# Altium schematic sheet Wigglagotchi.SchDoc: Wigglagotchi
size A3; Revision: 1; SheetNumber: 1; SheetTotal: 1; SPICEModelCacheJNQJJNNR: <root> / <DocumentId>JNQJJNNR</DocumentId> / </root>
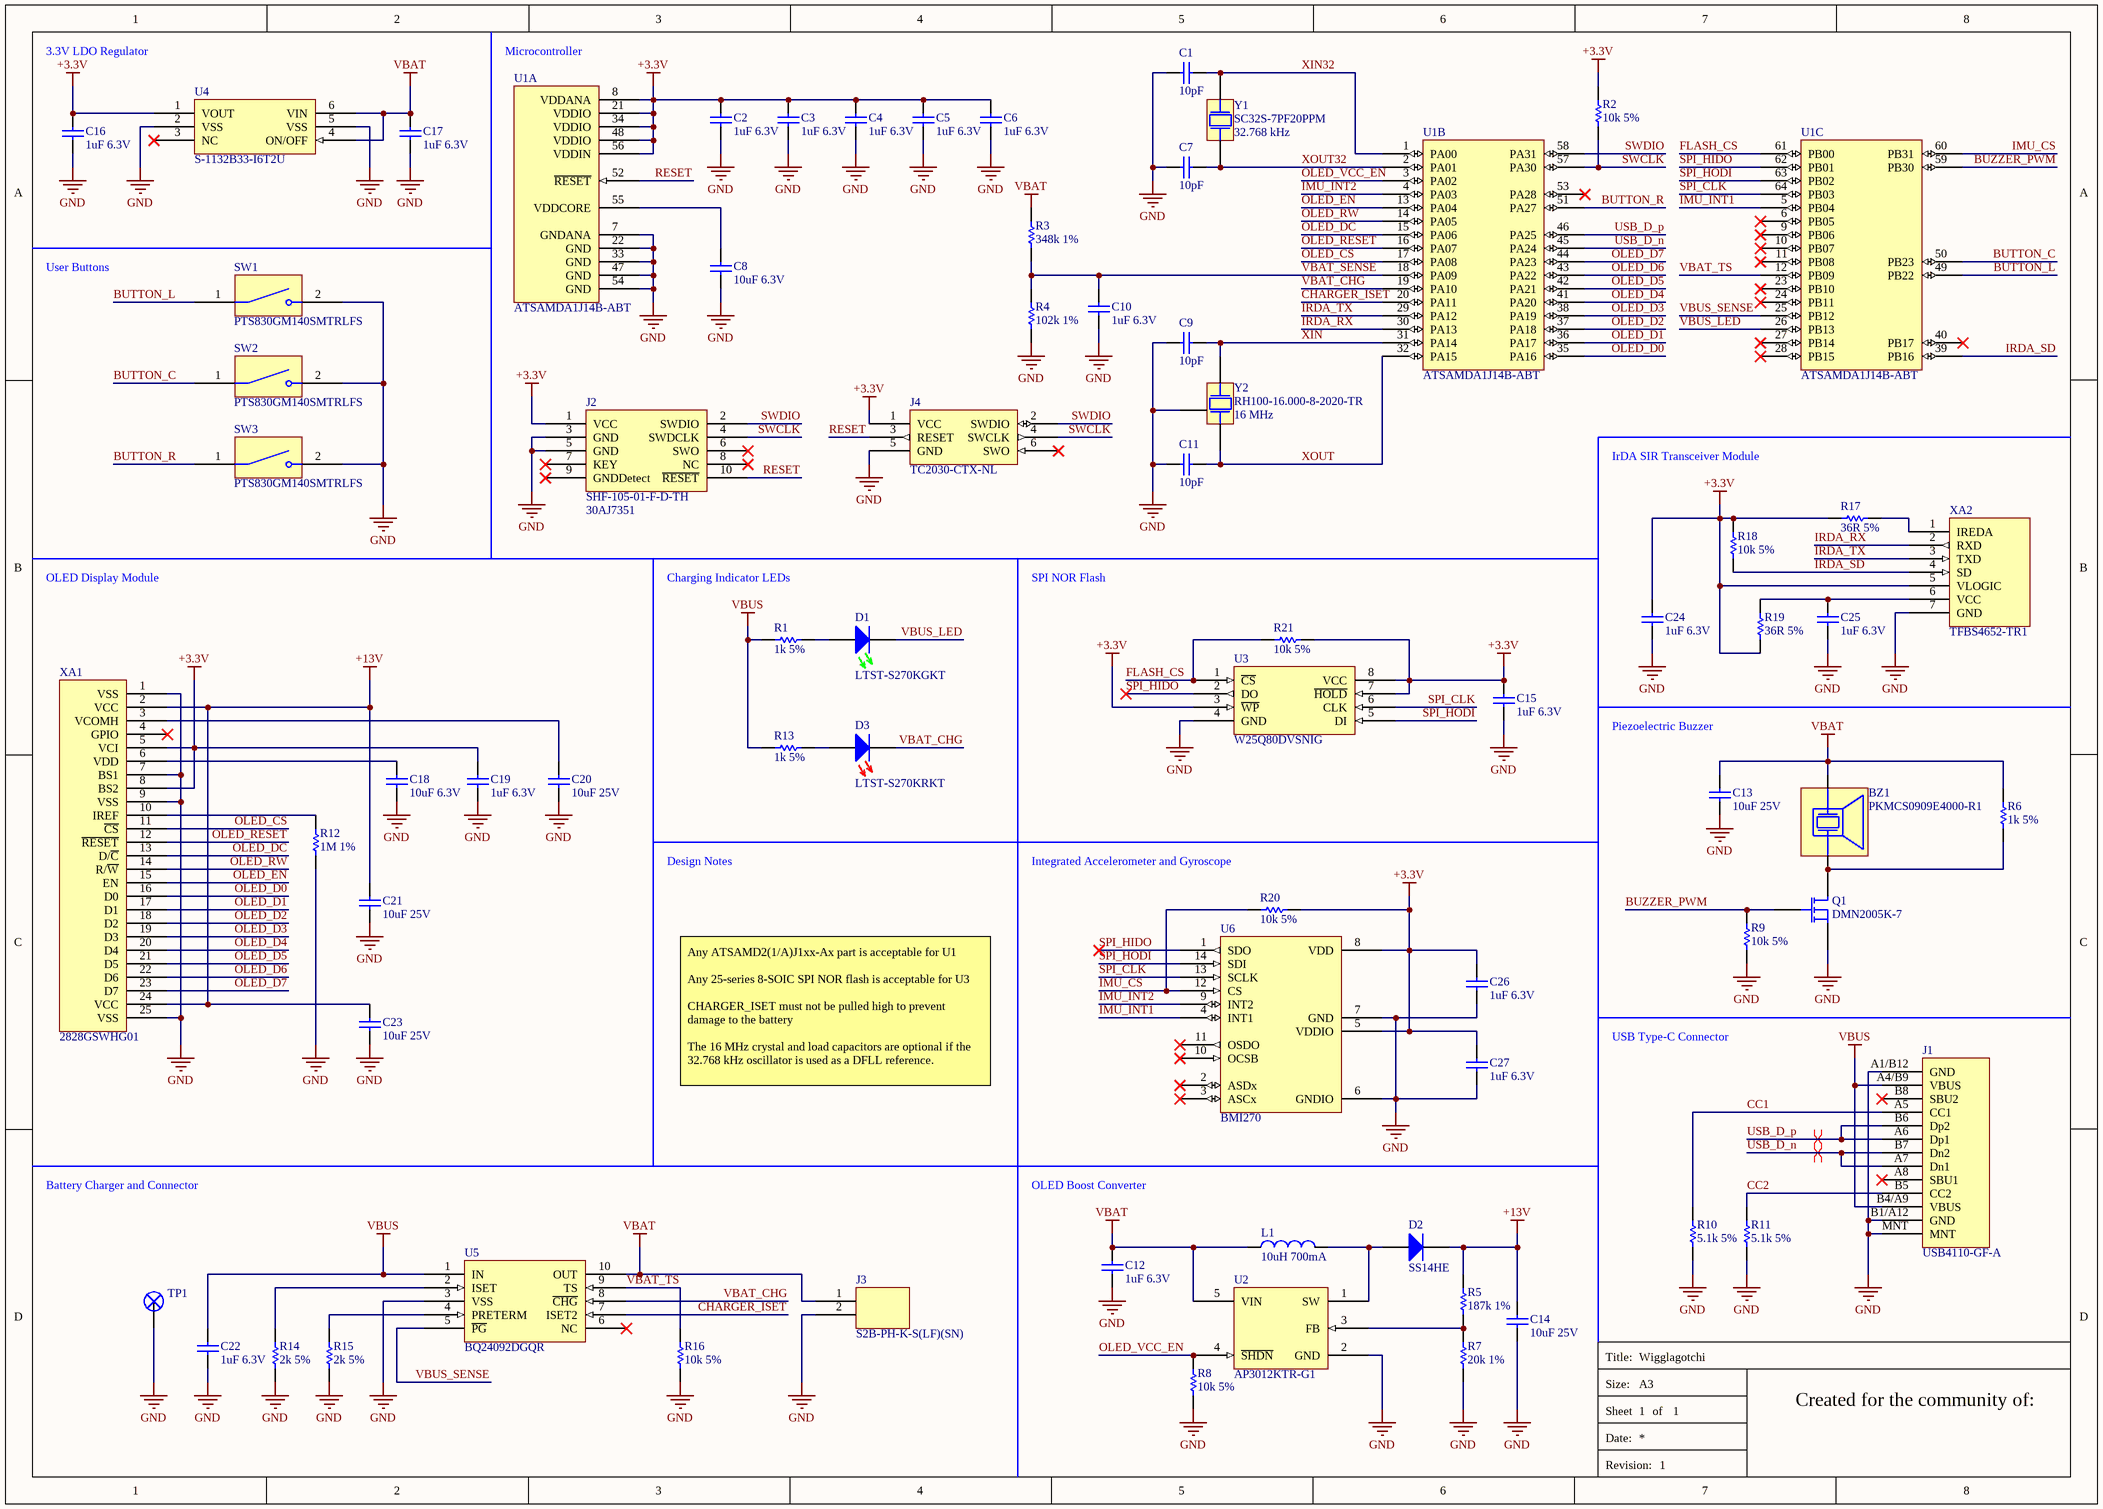
[diagram p0: Wigglagotchi.SchDoc]

## Parts
BZ1  PKMCS0909E4000-R1  [PKMCS0909E4000-R1]
C1  value 10pF  [GRM155 0402 Capacitor]  (hidden comment: GCM1555C1H100GA16D)
C2  value 1uF 6.3V  [GRM155 0402 Capacitor]  (hidden comment: GRM153R60J105ME15D)
C3  value 1uF 6.3V  [GRM155 0402 Capacitor]  (hidden comment: GRM153R60J105ME15D)
C4  value 1uF 6.3V  [GRM155 0402 Capacitor]  (hidden comment: GRM153R60J105ME15D)
C5  value 1uF 6.3V  [GRM155 0402 Capacitor]  (hidden comment: GRM153R60J105ME15D)
C6  value 1uF 6.3V  [GRM155 0402 Capacitor]  (hidden comment: GRM153R60J105ME15D)
C7  value 10pF  [GRM155 0402 Capacitor]  (hidden comment: GCM1555C1H100GA16D)
C8  value 10uF 6.3V  [GRM155 0402 Capacitor]  (hidden comment: GRM155R60J106ME15D)
C9  value 10pF  [GRM155 0402 Capacitor]  (hidden comment: GCM1555C1H100GA16D)
C10  value 1uF 6.3V  [GRM155 0402 Capacitor]  (hidden comment: GRM153R60J105ME15D)
C11  value 10pF  [GRM155 0402 Capacitor]  (hidden comment: GCM1555C1H100GA16D)
C12  value 1uF 6.3V  [GRM155 0402 Capacitor]  (hidden comment: GRM153R60J105ME15D)
C13  value 10uF 25V  [GRM21 0805 Capacitor]  (hidden comment: GRM21BR61E106KA73K)
C14  value 10uF 25V  [GRM21 0805 Capacitor]  (hidden comment: GRM21BR61E106KA73K)
C15  value 1uF 6.3V  [GRM155 0402 Capacitor]  (hidden comment: GRM153R60J105ME15D)
C16  value 1uF 6.3V  [GRM155 0402 Capacitor]  (hidden comment: GRM153R60J105ME15D)
C17  value 1uF 6.3V  [GRM155 0402 Capacitor]  (hidden comment: GRM153R60J105ME15D)
C18  value 10uF 6.3V  [GRM155 0402 Capacitor]  (hidden comment: GRM155R60J106ME15D)
C19  value 1uF 6.3V  [GRM155 0402 Capacitor]  (hidden comment: GRM153R60J105ME15D)
C20  value 10uF 25V  [GRM21 0805 Capacitor]  (hidden comment: GRM21BR61E106KA73K)
C21  value 10uF 25V  [GRM21 0805 Capacitor]  (hidden comment: GRM21BR61E106KA73K)
C22  value 1uF 6.3V  [GRM155 0402 Capacitor]  (hidden comment: GRM153R60J105ME15D)
C23  value 10uF 25V  [GRM21 0805 Capacitor]  (hidden comment: GRM21BR61E106KA73K)
C24  value 1uF 6.3V  [GRM155 0402 Capacitor]  (hidden comment: GRM153R60J105ME15D)
C25  value 1uF 6.3V  [GRM155 0402 Capacitor]  (hidden comment: GRM153R60J105ME15D)
C26  value 1uF 6.3V  [GRM155 0402 Capacitor]  (hidden comment: GRM153R60J105ME15D)
C27  value 1uF 6.3V  [GRM155 0402 Capacitor]  (hidden comment: GRM153R60J105ME15D)
D1  LTST-S270KGKT  [LTST-S270KRKT]
D2  SS14HE  [SS14HE]
D3  LTST-S270KRKT  [LTST-S270KRKT]
J1  USB4110-GF-A  [USB4110-GF-A]
J2  SHF-105-01-F-D-TH  Supplier Part Number 1: 30AJ7351  [SHF-105-01-F-D-TH]
J3  S2B-PH-K-S(LF)(SN)  [S2B-PH-K-S(LF)(SN)]
J4  TC2030-CTX-NL  [TC2030-CTX-NL]  (no BOM)
L1  value 10uH 700mA  [BRL3225T100K]  (hidden comment: BRL3225T100K)
Q1  DMN2005K-7  [DMN2005K-7]
R1  value 1k 5%  [RMCF0402 Resistor Package]  (hidden comment: RMCF0402JT1K00)
R2  value 10k 5%  [RMCF0402 Resistor Package]  (hidden comment: RMCF0402JT10K0)
R3  value 348k 1%  [RMCF0402 Resistor Package]  (hidden comment: RMCF0402FT348K)
R4  value 102k 1%  [RMCF0402 Resistor Package]  (hidden comment: RMCF0402FT102K)
R5  value 187k 1%  [RMCF0402 Resistor Package]  (hidden comment: RMCF0402FT187K)
R6  value 1k 5%  [RMCF0402 Resistor Package]  (hidden comment: RMCF0402JT1K00)
R7  value 20k 1%  [RMCF0402 Resistor Package]  (hidden comment: RMCF0402FT20K0)
R8  value 10k 5%  [RMCF0402 Resistor Package]  (hidden comment: RMCF0402JT10K0)
R9  value 10k 5%  [RMCF0402 Resistor Package]  (hidden comment: RMCF0402JT10K0)
R10  value 5.1k 5%  [RMCF0402 Resistor Package]  (hidden comment: RMCF0402JT5K10)
R11  value 5.1k 5%  [RMCF0402 Resistor Package]  (hidden comment: RMCF0402JT5K10)
R12  value 1M 1%  [RMCF0402 Resistor Package]  (hidden comment: RMCF0402FT1M00)
R13  value 1k 5%  [RMCF0402 Resistor Package]  (hidden comment: RMCF0402JT1K00)
R14  value 2k 5%  [RMCF0402 Resistor Package]  (hidden comment: RMCF0402JT2K00)
R15  value 2k 5%  [RMCF0402 Resistor Package]  (hidden comment: RMCF0402JT2K00)
R16  value 10k 5%  [RMCF0402 Resistor Package]  (hidden comment: RMCF0402JT10K0)
R17  value 36R 5%  [RMCF0402 Resistor Package]  (hidden comment: RMCF0402JT36R0)
R18  value 10k 5%  [RMCF0402 Resistor Package]  (hidden comment: RMCF0402JT10K0)
R19  value 36R 5%  [RMCF0402 Resistor Package]  (hidden comment: RMCF0402JT36R0)
R20  value 10k 5%  [RMCF0402 Resistor Package]  (hidden comment: RMCF0402JT10K0)
R21  value 10k 5%  [RMCF0402 Resistor Package]  (hidden comment: RMCF0402JT10K0)
SW1  PTS830GM140SMTRLFS  [PTS830GM140SMTRLFS]
SW2  PTS830GM140SMTRLFS  [PTS830GM140SMTRLFS]
SW3  PTS830GM140SMTRLFS  [PTS830GM140SMTRLFS]
TP1  5019  [5019 Test Point]  (value not drawn)
U1  ATSAMDA1J14B-ABT  [ATSAMDA1J15B-ABT]  (parts A,B,C of 3)
U2  AP3012KTR-G1  [AP3012KTR-G1]
U3  W25Q80DVSNIG  [W25Q80DVSNIG]
U4  S-1132B33-I6T2U  [S-1132B33-I6T2U]
U5  BQ24092DGQR  [BQ24095DGQR]
U6  BMI270  [BMI270]
XA1  2828GSWHG01  [2828GSWHG01 OLED]  (no BOM)
XA2  TFBS4652-TR1  [TFBS4652-TR1]
Y1  SC32S-7PF20PPM  value 32.768 kHz  [SC32S-7PF20PPM]
Y2  RH100-16.000-8-2020-TR  value 16 MHz  [RH100-16.000-8-2020-TR]

## Nets
+3.3V: C2.2 C3.2 C4.2 C5.2 C6.2 C15.2 C16.2 C19.2 C24.2 C26.2 C27.2 J2.1(VCC) J4.1(VCC) R2.2 R17.1 R18.2 R19.1 R20.1 R21.1 U1.8(VDDANA) U1.21(VDDIO) U1.34(VDDIO) U1.48(VDDIO) U1.56(VDDIN) U3.3(~{WP}) U3.7(~{HOLD}) U3.8(VCC) U4.1(VOUT) U6.5(VDDIO) U6.8(VDD) XA1.5(VCI) XA1.8(BS2) XA2.5(VLOGIC)
+13V: C14.2 C21.2 C23.2 D2.1 R5.2 XA1.2(VCC) XA1.24(VCC)
GND: C1.2 C2.1 C3.1 C4.1 C5.1 C6.1 C7.2 C8.1 C9.2 C10.1 C11.2 C12.1 C13.1 C14.1 C15.1 C16.1 C17.1 C18.1 C19.1 C20.1 C21.1 C22.1 C23.1 C24.1 C25.1 C26.1 C27.1 J1.A1/B12(GND) J1.B1/A12(GND) J1.MNT J2.3(GND) J2.5(GND) J3.2 J4.5(GND) Q1.S R4.1 R7.1 R8.1 R9.1 R10.1 R11.1 R12.1 R14.2 R15.1 R16.1 SW1.2 SW2.2 SW3.2 TP1.1 U1.7(GNDANA) U1.22(GND) U1.33(GND) U1.47(GND) U1.54(GND) U2.2(GND) U3.4(GND) U4.2(VSS) U4.5(VSS) U5.3(VSS) U6.6(GNDIO) U6.7(GND) XA1.1(VSS) XA1.7(BS1) XA1.9(VSS) XA1.25(VSS) XA2.7(GND) Y2.2(GND)
VBAT: BZ1.1 C12.2 C13.2 C17.2 J3.1 L1.1 R3.2 R6.2 U2.5(VIN) U4.4(ON/OFF) U4.6(VIN) U5.10(OUT)
VBUS: C22.2 J1.A4/B9(VBUS) J1.B4/A9(VBUS) R1.2 R13.2 U5.1(IN)
BUTTON_C: SW2.1 U1.50(PB23)
BUTTON_L: SW1.1 U1.49(PB22)
BUTTON_R: SW3.1 U1.51(PA27)
BUZZER_PWM: Q1.G R9.2 U1.59(PB30)
CC1: J1.A5(CC1) R10.2
CC2: J1.B5(CC2) R11.2
CHARGER_ISET: U1.20(PA11) U5.7(ISET2)
FLASH_CS: R21.2 U1.61(PB00) U3.1(~{CS})
IMU_CS: R20.2 U1.60(PB31) U6.12(CS)
IMU_INT1: U1.5(PB04) U6.4(INT1)
IMU_INT2: U1.4(PA03) U6.9(INT2)
IRDA_RX: U1.30(PA13) XA2.2(RXD)
IRDA_SD: R18.1 U1.39(PB16) XA2.4(SD)
IRDA_TX: U1.29(PA12) XA2.3(TXD)
OLED_CS: U1.17(PA08) XA1.11(~{CS})
OLED_D0: U1.35(PA16) XA1.16(D0)
OLED_D1: U1.36(PA17) XA1.17(D1)
OLED_D2: U1.37(PA18) XA1.18(D2)
OLED_D3: U1.38(PA19) XA1.19(D3)
OLED_D4: U1.41(PA20) XA1.20(D4)
OLED_D5: U1.42(PA21) XA1.21(D5)
OLED_D6: U1.43(PA22) XA1.22(D6)
OLED_D7: U1.44(PA23) XA1.23(D7)
OLED_DC: U1.15(PA06) XA1.13(D/~{C})
OLED_EN: U1.13(PA04) XA1.15(EN)
OLED_RESET: U1.16(PA07) XA1.12(~{RESET})
OLED_RW: U1.14(PA05) XA1.14(R/~{W})
OLED_VCC_EN: R8.2 U1.3(PA02) U2.4(~{SHDN})
RESET: J2.10(~{RESET}) J4.3(RESET) U1.52(~{RESET})
SPI_CLK: U1.64(PB03) U3.6(CLK) U6.13(SCLK)
SPI_HIDO: U1.62(PB01) U3.2(DO) U6.1(SDO)
SPI_HODI: U1.63(PB02) U3.5(DI) U6.14(SDI)
SWCLK: J2.4(SWDCLK) J4.4(SWCLK) R2.1 U1.57(PA30)
SWDIO: J2.2(SWDIO) J4.2(SWDIO) U1.58(PA31)
USB_D_n: J1.A7(Dn1) J1.B7(Dn2) U1.45(PA24)
USB_D_p: J1.A6(Dp1) J1.B6(Dp2) U1.46(PA25)
VBAT_CHG: D3.1 U1.19(PA10) U5.8(~{CHG})
VBAT_SENSE: C10.2 R3.1 R4.2 U1.18(PA09)
VBAT_TS: R16.2 U1.12(PB09) U5.9(TS)
VBUS_LED: D1.1 U1.26(PB13)
VBUS_SENSE: U1.25(PB12) U5.5(~{PG})
XIN: C9.1 U1.31(PA14) Y2.3(X2)
XIN32: C1.1 U1.1(PA00) Y1.2(X2)
XOUT: C11.1 U1.32(PA15) Y2.1(X1)
XOUT32: C7.1 U1.2(PA01) Y1.1(X1)
NetBZ1_2: BZ1.2 Q1.D R6.1
NetC8_2: C8.2 U1.55(VDDCORE)
NetC18_2: C18.2 XA1.6(VDD)
NetC20_2: C20.2 XA1.3(VCOMH)
NetC25_2: C25.2 R19.2 XA2.6(VCC)
NetD1_2: D1.2 R1.1
NetD2_2: D2.2 L1.2 U2.1(SW)
NetD3_2: D3.2 R13.1
NetR5_1: R5.1 R7.2 U2.3(FB)
NetR12_2: R12.2 XA1.10(IREF)
NetR14_1: R14.1 U5.2(ISET)
NetR15_2: R15.2 U5.4(PRETERM)
NetR17_2: R17.2 XA2.1(IREDA)

Not connected (* = marked no-connect by the designer): J1 A8(SBU1)* B8(SBU2)*; J2 6(SWO)* 7(KEY)* 8(NC)* 9(GNDDetect)*; J4 6(SWO)*; U1 6(PB05)* 9(PB06)* 10(PB07)* 11(PB08)* 23(PB10)* 24(PB11)* 27(PB14)* 28(PB15)* 40(PB17)* 53(PA28)*; U4 3(NC)*; U5 6(NC)*; U6 2(ASDx)* 3(ASCx)* 10(OCSB)* 11(OSDO)*; XA1 4(GPIO)*

## Layout directives
differential pair: USB_D_n, USB_D_p

## Notes on the sheet
- 3.3V LDO Regulator
- (near U1) Microcontroller
- User Buttons
- IrDA SIR Transceiver Module
- OLED Display Module
- Charging Indicator LEDs
- SPI NOR Flash
- Piezoelectric Buzzer
- Design Notes
- (near R20) Integrated Accelerometer and Gyroscope
- USB Type-C Connector
- Any ATSAMD2(1/A)J1xx-Ax part is acceptable for U1
  Any 25-series 8-SOIC SPI NOR flash is acceptable for U3
  CHARGER_ISET must not be pulled high to prevent damage to the battery
  The 16 MHz crystal and load capacitors are optional if the 32.768 kHz oscillator is used as a DFLL reference.
- Battery Charger and Connector
- OLED Boost Converter
- Title:
- Size:
- Sheet
- A3
- of
- Created for the community of:
- Date:
- Revision:

## Library data of the parts
BZ1 = PKMCS0909E4000-R1: Buzzers Transducer, Externally Driven Piezo 1.5 V 4kHz 65dB @ 1.5V, 10cm Surface Mount Solder Pads; Supplier 1: Arrow Electronics; Supplier Part Number 1: PKMCS0909E4000-R1
C1 C7 C9 C11 = GCM1555C1H100GA16D: 10 pF ±2% 50V Ceramic Capacitor C0G, NP0 0402 (1005 Metric); Supplier 1: Arrow Electronics; Supplier Part Number 1: GCM1555C1H100GA16D
C2-C6 C10 C12 C15-C17 C19 C22 C24-C27 = GRM153R60J105ME15D: 1 µF ±20% 6.3V Ceramic Capacitor X5R 0402 (1005 Metric)
C8 C18 = GRM155R60J106ME15D: 10 µF ±20% 6.3V Ceramic Capacitor X5R 0402 (1005 Metric)
C13 C14 C20 C21 C23 = GRM21BR61E106KA73K: 10 µF ±10% 25V Ceramic Capacitor X5R 0805 (2012 Metric); Supplier 1: Arrow Electronics; Supplier Part Number 1: GRM21BR61E106KA73K
D1 = LTST-S270KGKT: Green 571nm LED Indication - Discrete 2V 0603 (1608 Metric); Supplier 1: RSComponents; Supplier Part Number 1: 6921219
D2 = SS14HE: Diode Schottky 40 V 1A Surface Mount SOD-323HE; Supplier 1: Newark; Supplier Part Number 1: 74AC1975
D3 = LTST-S270KRKT: Red 631nm LED Indication - Discrete 2V 0603 (1608 Metric); Supplier 1: Arrow Electronics; Supplier Part Number 1: LTST-S270KRKT
J1 = USB4110-GF-A: USB-C (USB TYPE-C) USB 2.0 Receptacle Connector 24 (16+8 Dummy) Position Surface Mount, Right Angle; Supplier 1: Newark; Supplier Part Number 1: 71AJ9394
J2 = SHF-105-01-F-D-TH: Connector Header Through Hole 10 position 0.050" (1.27mm); Supplier 1: Newark
J3 = S2B-PH-K-S(LF)(SN): Connector Header Through Hole, Right Angle 2 position 0.079" (2.00mm); Supplier 1: RSComponents; Supplier Part Number 1: 8201494
J4 = TC2030-CTX-NL: 6-Pin “No Legs” Cable with 10-pin micro-connector for Cortex processors
L1 = BRL3225T100K: 10 µH Unshielded Drum Core, Wirewound Inductor 700 mA 420mOhm Max 1210 (3225 Metric); Supplier 1: Arrow Electronics; Supplier Part Number 1: BRL3225T100K
Q1 = DMN2005K-7: N-Channel 20 V 300mA (Ta) 350mW (Ta) Surface Mount SOT-23-3; Supplier 1: Arrow Electronics; Supplier Part Number 1: DMN2005K-7
R1 R6 R13 = RMCF0402JT1K00: 1 kOhms ±5% 0.063W, 1/16W Chip Resistor 0402 (1005 Metric) Automotive AEC-Q200 Thick Film; Supplier 1: Arrow Electronics; Supplier Part Number 1: RMCF0402JT1K00
R2 R8 R9 R16 R18 R20 R21 = RMCF0402JT10K0: 10 kOhms ±5% 0.063W, 1/16W Chip Resistor 0402 (1005 Metric) Automotive AEC-Q200 Thick Film; Supplier 1: Arrow Electronics; Supplier Part Number 1: RMCF0402JT10K0
R3 = RMCF0402FT348K: 348 kOhms ±1% 0.063W, 1/16W Chip Resistor 0402 (1005 Metric) Automotive AEC-Q200 Thick Film; Supplier 1: Arrow Electronics; Supplier Part Number 1: RMCF0402FT348K
R4 = RMCF0402FT102K: 102 kOhms ±1% 0.063W, 1/16W Chip Resistor 0402 (1005 Metric) Automotive AEC-Q200 Thick Film; Supplier 1: Arrow Electronics; Supplier Part Number 1: RMCF0402FT102K
R5 = RMCF0402FT187K: 187 kOhms ±1% 0.063W, 1/16W Chip Resistor 0402 (1005 Metric) Automotive AEC-Q200 Thick Film; Supplier 1: Digi-Key; Supplier Part Number 1: RMCF0402FT187KCT-ND
R7 = RMCF0402FT20K0: 20 kOhms ±1% 0.063W, 1/16W Chip Resistor 0402 (1005 Metric) Automotive AEC-Q200 Thick Film; Supplier 1: Arrow Electronics; Supplier Part Number 1: RMCF0402FT20K0
R10 R11 = RMCF0402JT5K10: 5.1 kOhms ±5% 0.063W, 1/16W Chip Resistor 0402 (1005 Metric) Automotive AEC-Q200 Thick Film; Supplier 1: Arrow Electronics; Supplier Part Number 1: RMCF0402JT5K10
R12 = RMCF0402FT1M00: 1 MOhms ±1% 0.063W, 1/16W Chip Resistor 0402 (1005 Metric) Automotive AEC-Q200 Thick Film; Supplier 1: Arrow Electronics; Supplier Part Number 1: RMCF0402FT1M00
R14 R15 = RMCF0402JT2K00: 2 kOhms ±5% 0.063W, 1/16W Chip Resistor 0402 (1005 Metric) Automotive AEC-Q200 Thick Film; Supplier 1: Arrow Electronics; Supplier Part Number 1: RMCF0402JT2K00
R17 R19 = RMCF0402JT36R0: 36 Ohms ±5% 0.063W, 1/16W Chip Resistor 0402 (1005 Metric) Automotive AEC-Q200 Thick Film; Supplier 1: Digi-Key; Supplier Part Number 1: 738-RMCF0402JT36R0CT-ND
SW1-SW3 = PTS830GM140SMTRLFS: Tactile Switch SPST-NO Top Actuated Surface Mount; Supplier 1: Arrow Electronics; Supplier Part Number 1: PTS830GM140SMTRLFS
TP1 = 5019: PC Test Point, Miniature Phosphor Bronze Silver Plating Surface Mount Mounting Type; Supplier 1: Newark; Supplier Part Number 1: 06W4636
U1 = ATSAMDA1J14B-ABT: ARM® Cortex®-M0+ series Microcontroller IC 32-Bit Single-Core 48MHz 16KB (16K x 8) FLASH 64-TQFP (10x10); Supplier 1: Arrow Electronics; Supplier Part Number 1: ATSAMDA1J14B-ABT
U2 = AP3012KTR-G1: Boost Switching Regulator IC Positive Adjustable 1.25V 1 Output 500mA (Switch) SC-74A, SOT-753; Supplier 1: Arrow Electronics; Supplier Part Number 1: AP3012KTR-G1
U3 = W25Q80DVSNIG: FLASH - NOR Memory IC 8Mb (1M x 8) SPI - Quad I/O 104 MHz 8-SOIC; Supplier 1: Arrow Electronics; Supplier Part Number 1: W25Q80DVSNIG
U4 = S-1132B33-I6T2U: Linear Voltage Regulator IC Positive Fixed 1 Output 300mA SNT-6A; Supplier 1: Digi-Key; Supplier Part Number 1: 1662-1266-1-ND
U5 = BQ24092DGQR: Charger IC Lithium Ion/Polymer 10-HVSSOP; Supplier 1: Mouser; Supplier Part Number 1: 595-BQ24092DGQR
U6 = BMI270: Accelerometer, Gyroscope, 6 Axis Sensor I²C, SPI Output; Supplier 1: RSComponents; Supplier Part Number 1: 2457369P
XA1 = 2828GSWHG01: 1.5 in. monochrome 128x128 OLED display module
XA2 = TFBS4652-TR1: 115.2kbs (SIR) IRDA Transceiver Side View; Supplier 1: Arrow Electronics; Supplier Part Number 1: TFBS4652-TR1
Y1 = SC32S-7PF20PPM: 32.768 kHz ±20ppm Crystal 7pF 70 kOhms 2-SMD, No Lead; Supplier 1: Mouser; Supplier Part Number 1: 628-SC32S-7PF20PPM
Y2 = RH100-16.000-8-2020-TR: 16 MHz ±20ppm Crystal 8pF 70 Ohms 4-SMD, No Lead; Supplier 1: Digi-Key; Supplier Part Number 1: 2151-RH100-16.000-8-2020-TRCT-ND